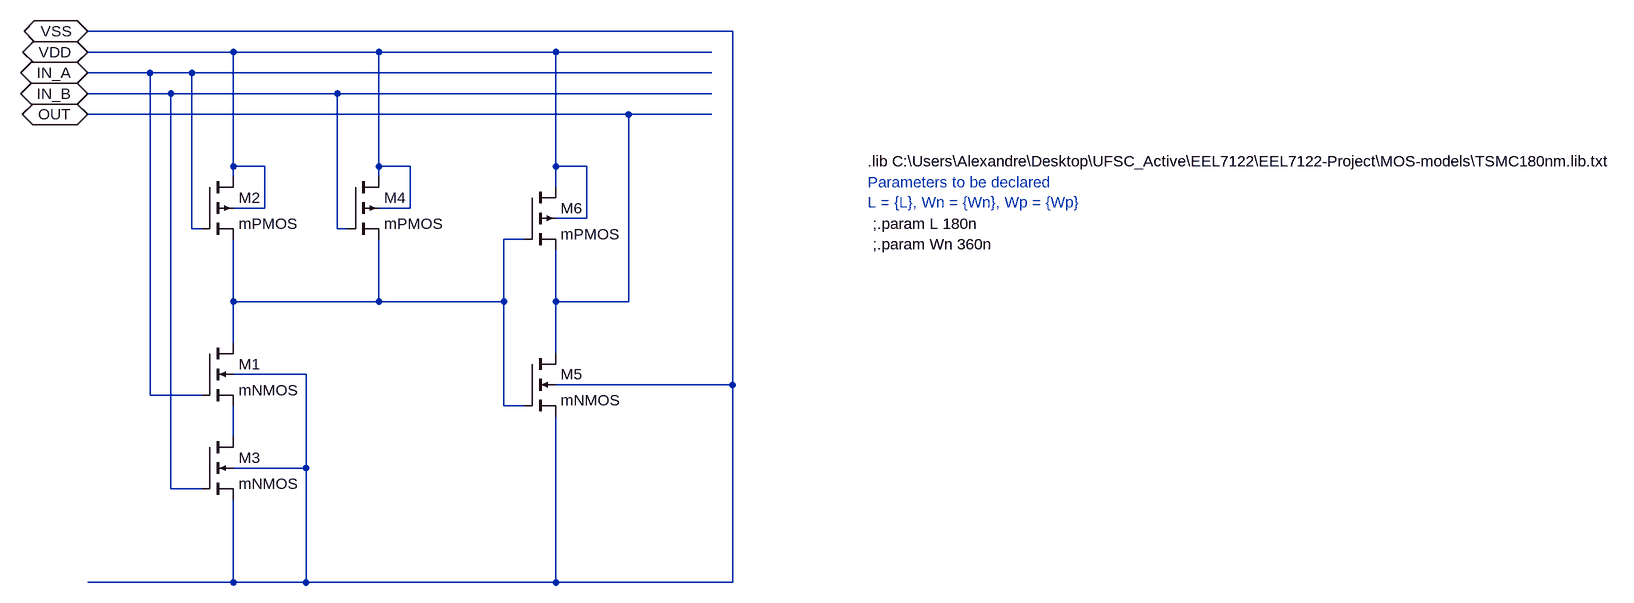
[diagram p0: schematic AND_SRAM.asc]
AND_SRAM.asc, the LTspice schematic file:
Version 4
SHEET 1 2396 680
WIRE 928 -176 -64 -176
WIRE 160 -144 -64 -144
WIRE 384 -144 160 -144
WIRE 656 -144 384 -144
WIRE 896 -144 656 -144
WIRE 32 -112 -64 -112
WIRE 96 -112 32 -112
WIRE 896 -112 96 -112
WIRE 64 -80 -64 -80
WIRE 320 -80 64 -80
WIRE 896 -80 320 -80
WIRE 768 -48 -64 -48
WIRE 896 -48 768 -48
WIRE 160 32 160 -144
WIRE 208 32 160 32
WIRE 384 32 384 -144
WIRE 432 32 384 32
WIRE 656 32 656 -144
WIRE 704 32 656 32
WIRE 160 48 160 32
WIRE 384 48 384 32
WIRE 656 64 656 32
WIRE 208 96 208 32
WIRE 208 96 160 96
WIRE 432 96 432 32
WIRE 432 96 384 96
WIRE 704 112 704 32
WIRE 704 112 656 112
WIRE 96 128 96 -112
WIRE 112 128 96 128
WIRE 320 128 320 -80
WIRE 336 128 320 128
WIRE 608 144 576 144
WIRE 160 240 160 144
WIRE 384 240 384 144
WIRE 384 240 160 240
WIRE 576 240 576 144
WIRE 576 240 384 240
WIRE 656 240 656 160
WIRE 768 240 768 -48
WIRE 768 240 656 240
WIRE 160 304 160 240
WIRE 656 320 656 240
WIRE 272 352 160 352
WIRE 928 368 928 -176
WIRE 928 368 656 368
WIRE 32 384 32 -112
WIRE 112 384 32 384
WIRE 576 400 576 240
WIRE 608 400 576 400
WIRE 160 448 160 400
WIRE 272 496 272 352
WIRE 272 496 160 496
WIRE 64 528 64 -80
WIRE 112 528 64 528
WIRE 160 672 160 544
WIRE 160 672 -64 672
WIRE 272 672 272 496
WIRE 272 672 160 672
WIRE 656 672 656 416
WIRE 656 672 272 672
WIRE 928 672 928 368
WIRE 928 672 656 672
FLAG -64 -48 OUT
IOPIN -64 -48 BiDir
FLAG -64 -144 VDD
IOPIN -64 -144 BiDir
FLAG -64 -176 VSS
IOPIN -64 -176 BiDir
FLAG -64 -112 IN_A
IOPIN -64 -112 BiDir
FLAG -64 -80 IN_B
IOPIN -64 -80 BiDir
SYMBOL nmos4 112 304 R0
SYMATTR InstName M1
SYMATTR Value mNMOS
SYMATTR Value2 l={L} w={2*Wn} ad={2*L*Wn} as={2*L*Wn} pd={2*2*Wn} ps={2*2*Wn} m=1
SYMBOL pmos4 112 48 R0
SYMATTR InstName M2
SYMATTR Value mPMOS
SYMATTR Value2 l={L} w={Wp} ad={2*Wn*L} as={2*Wn*L} pd={2*2*Wn} ps={2*2*Wn} m=1
SYMBOL nmos4 112 448 R0
SYMATTR InstName M3
SYMATTR Value mNMOS
SYMATTR Value2 l={L} w={2*Wn} ad={2*L*Wn} as={2*L*Wn} pd={2*2*Wn} ps={2*2*Wn} m=1
SYMBOL pmos4 336 48 R0
SYMATTR InstName M4
SYMATTR Value mPMOS
SYMATTR Value2 l={L} w={Wp} ad={2*Wn*L} as={2*Wn*L} pd={2*2*Wn} ps={2*2*Wn} m=1
SYMBOL nmos4 608 320 R0
SYMATTR InstName M5
SYMATTR Value mNMOS
SYMATTR Value2 l={L} w={Wn} ad={L*Wn} as={L*Wn} pd={2*Wn} ps={2*Wn} m=1
SYMBOL pmos4 608 64 R0
SYMATTR InstName M6
SYMATTR Value mPMOS
SYMATTR Value2 l={L} w={Wp} ad={2*Wn*L} as={2*Wn*L} pd={2*2*Wn} ps={2*2*Wn} m=1
TEXT 1136 24 Left 2 !.lib C:\\Users\\Alexandre\\Desktop\\UFSC_Active\\EEL7122\\EEL7122-Project\\MOS-models\\TSMC180nm.lib.txt
TEXT 1144 120 Left 2 !;.param L 180n
TEXT 1144 152 Left 2 !;.param Wn 360n
TEXT 1136 56 Left 2 ;Parameters to be declared\nL = {L}, Wn = {Wn}, Wp = {Wp}

The netlist it stands for:
* AND_SRAM.asc
M1 N001 IN_A N002 VSS mNMOS l={L} w={2*Wn} ad={2*L*Wn} as={2*L*Wn} pd={2*2*Wn} ps={2*2*Wn} m=1
M2 VDD IN_A N001 VDD mPMOS l={L} w={Wp} ad={2*Wn*L} as={2*Wn*L} pd={2*2*Wn} ps={2*2*Wn} m=1
M3 N002 IN_B VSS VSS mNMOS l={L} w={2*Wn} ad={2*L*Wn} as={2*L*Wn} pd={2*2*Wn} ps={2*2*Wn} m=1
M4 VDD IN_B N001 VDD mPMOS l={L} w={Wp} ad={2*Wn*L} as={2*Wn*L} pd={2*2*Wn} ps={2*2*Wn} m=1
M5 OUT N001 VSS VSS mNMOS l={L} w={Wn} ad={L*Wn} as={L*Wn} pd={2*Wn} ps={2*Wn} m=1
M6 VDD N001 OUT VDD mPMOS l={L} w={Wp} ad={2*Wn*L} as={2*Wn*L} pd={2*2*Wn} ps={2*2*Wn} m=1
.model NMOS NMOS
.model PMOS PMOS
.lib standard.mos
.lib C:\Users\Alexandre\Desktop\UFSC_Active\EEL7122\EEL7122-Project\MOS-models\TSMC180nm.lib.txt
;.param L 180n
;.param Wn 360n
* Parameters to be declared
* L = {L}, Wn = {Wn}, Wp = {Wp}
.backanno
.end